# EAGLE design CharlieBreakout (EAGLE 6.5.0)
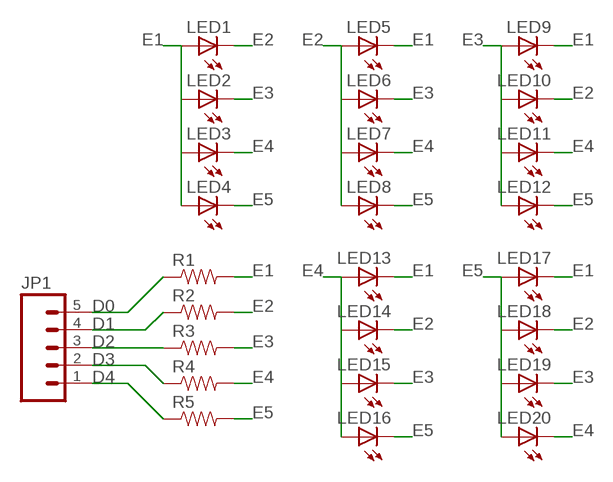
[diagram p0: schematic, sheet 1]

## Parts
JP1  M05PTH  [1X05]
LED1  LED3MM  [LED3MM]
LED2  LED3MM  [LED3MM]
LED3  LED3MM  [LED3MM]
LED4  LED3MM  [LED3MM]
LED5  LED3MM  [LED3MM]
LED6  LED3MM  [LED3MM]
LED7  LED3MM  [LED3MM]
LED8  LED3MM  [LED3MM]
LED9  LED3MM  [LED3MM]
LED10  LED3MM  [LED3MM]
LED11  LED3MM  [LED3MM]
LED12  LED3MM  [LED3MM]
LED13  LED3MM  [LED3MM]
LED14  LED3MM  [LED3MM]
LED15  LED3MM  [LED3MM]
LED16  LED3MM  [LED3MM]
LED17  LED3MM  [LED3MM]
LED18  LED3MM  [LED3MM]
LED19  LED3MM  [LED3MM]
LED20  LED3MM  [LED3MM]
R1  RESISTORAXIAL-0.3  [AXIAL-0.3]
R2  RESISTORAXIAL-0.3  [AXIAL-0.3]
R3  RESISTORAXIAL-0.3  [AXIAL-0.3]
R4  RESISTORAXIAL-0.3  [AXIAL-0.3]
R5  RESISTORAXIAL-0.3  [AXIAL-0.3]

## Nets
D0: JP1.5 R1.P$1
D1: JP1.4 R2.P$1
D2: JP1.3 R3.P$1
D3: JP1.2 R4.P$1
D4: JP1.1 R5.P$1
E1: LED1.A LED2.A LED3.A LED4.A LED5.K(C) LED9.K(C) LED13.K(C) LED17.K(C) R1.P$2
E2: LED1.K(C) LED5.A LED6.A LED7.A LED8.A LED10.K(C) LED14.K(C) LED18.K(C) R2.P$2
E3: LED2.K(C) LED6.K(C) LED9.A LED10.A LED11.A LED12.A LED15.K(C) LED19.K(C) R3.P$2
E4: LED3.K(C) LED7.K(C) LED11.K(C) LED13.A LED14.A LED15.A LED16.A LED20.K(C) R4.P$2
E5: LED4.K(C) LED8.K(C) LED12.K(C) LED16.K(C) LED17.A LED18.A LED19.A LED20.A R5.P$2

## Library data of the parts
JP1 = SparkFun-Connectors:M05: Header 5 Standard 5-pin 0.1" header. Use with straight break away headers (SKU : PRT-00116), right angle break away headers (PRT-00553), swiss pins (PRT-00743), machine pins (PRT-00117), and female headers (PRT-00115). Molex polarized connector foot print use with SKU : PRT-08230 with associated crimp pins and housings.
LED1-LED20 = SparkFun-LED:LED: LEDs Standard schematic elements and footprints for 5mm, 3mm, 1206, and 0603 sized LEDs. 5mm - Spark Fun Electronics SKU : COM-00529 (and others)
R1-R5 = SparkFun-Resistors:RESISTOR: Resistor Basic schematic elements and footprints for 0603, 1206, and PTH resistors.

## Board
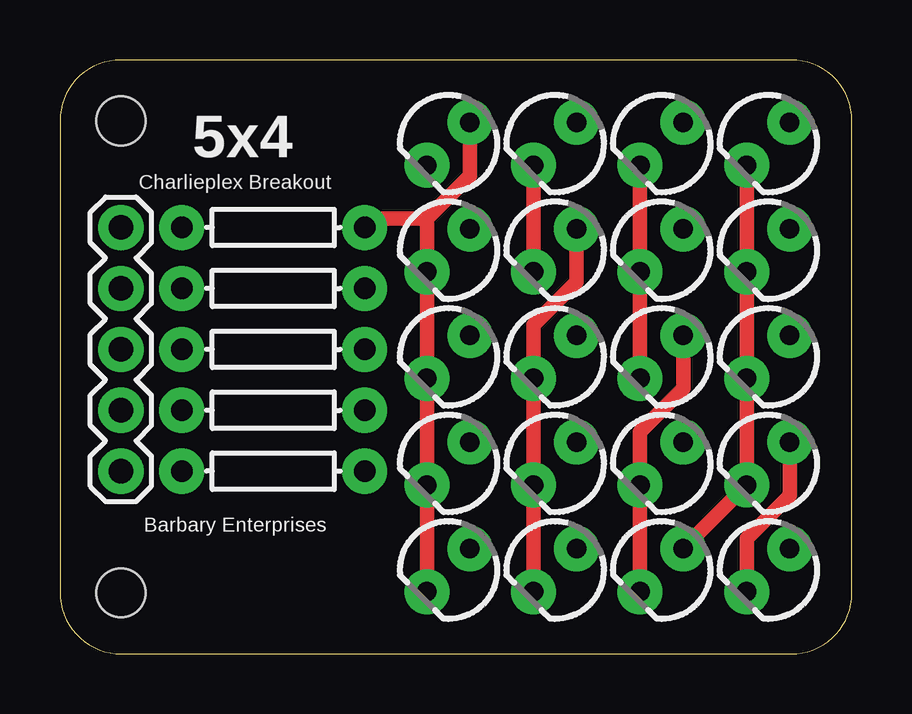
[diagram p1: board, top side]
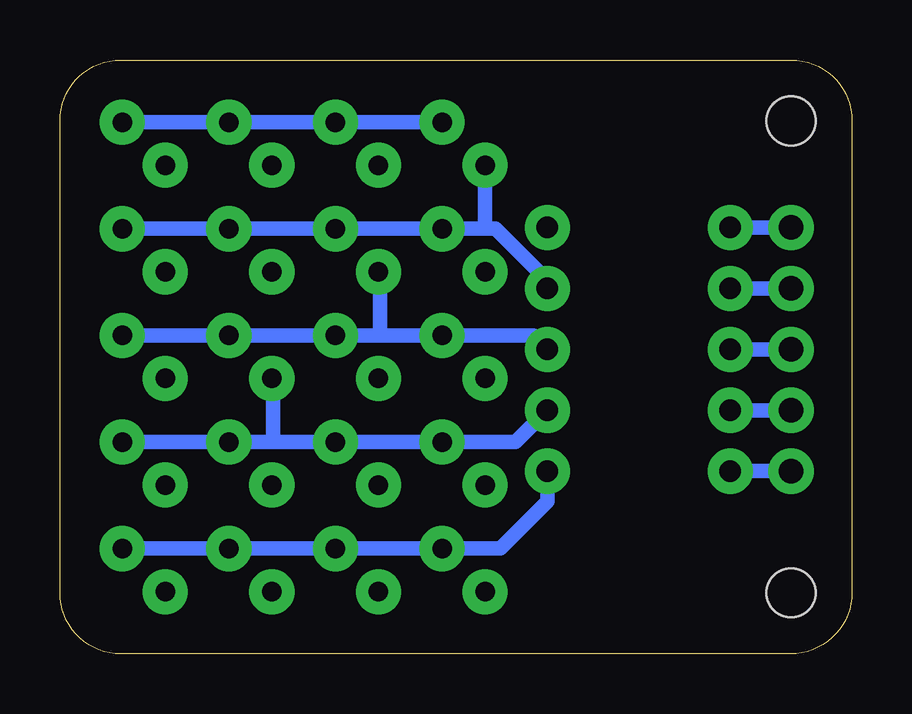
[diagram p2: board, bottom side, seen from below]

Size 33.02 x 24.77 mm. Coordinates in mm from the lower left corner, seen from the top.
Outline: 30.48,24.77 2.54,24.77 arc90 0,22.23 0,2.56 arc90 2.56,0 30.48,0 arc90 33.02,2.54 33.02,22.23 arc90 30.48,24.77
Copper layers (1*16): Top 0.0356mm / dielectric 1.5011mm / Bottom 0.0356mm
Design rules "LaenPCBOrder": minimum track width 6mil, minimum drill 13mil, track to track 6mil, track to pad 6mil, pad to pad 6mil, via to via 6mil, smd to smd 6mil, copper to edge 15mil, drill to drill 6mil, minimum pad ring 7mil, minimum via ring 7mil, stop-mask expansion 3mil, vias tented up to drill 0mil, thermal gap 10mil
Holes 2.03 mm at 2.54,2.54 2.54,22.23

### Footprints (pad centres in the part's own frame; a part is rotated, then mirrored left to right if it is on the bottom)
1X05 = drill 1.016 pad 1.88: 1 0,0; 2 2.54,0; 3 5.08,0; 4 7.62,0; 5 10.16,0
LED3MM = drill 0.813 pad 1.88: A -1.27,0; K 1.27,0
AXIAL-0.3 = drill 0.9 pad 1.88: P$1 -3.81,0; P$2 3.81,0

### Placement (x,y rotation side)
JP1  2.54,7.62 90 top
LED1  16.19,21.27 225 top
LED2  20.64,21.27 225 top
LED3  25.08,21.27 225 top
LED4  29.53,21.27 225 top
LED5  16.19,16.83 225 top
LED6  20.64,16.83 225 top
LED7  25.08,16.83 225 top
LED8  29.53,16.83 225 top
LED9  16.19,12.38 225 top
LED10  20.64,12.38 225 top
LED11  25.08,12.38 225 top
LED12  29.53,12.38 225 top
LED13  16.19,7.94 225 top
LED14  20.64,7.94 225 top
LED15  25.08,7.94 225 top
LED16  29.53,7.94 225 top
LED17  16.19,3.49 225 top
LED18  20.64,3.49 225 top
LED19  25.08,3.49 225 top
LED20  29.53,3.49 225 top
R1  8.89,17.78 0 top
R2  8.89,15.24 0 top
R3  8.89,12.7 0 top
R4  8.89,10.16 0 top
R5  8.89,7.62 0 top

### Tracks (layer width: path | path; a pad name or v marks a point on that pad's centre or on a via)
D0
  Bottom 0.61: JP1.5 R1.P$1
D1
  Bottom 0.61: JP1.4 R2.P$1
D2
  Bottom 0.61: JP1.3 R3.P$1
D3
  Bottom 0.61: JP1.2 R4.P$1
D4
  Bottom 0.61: JP1.1 R5.P$1
E1
  Top 0.61: LED17.K LED13.K LED9.K LED5.K 15.29,18.15 | 15.29,18.15 17.09,19.95 LED1.A | 15.29,18.15 13.07,18.15 R1.P$2
  Bottom 0.61: LED4.A LED3.A LED2.A LED1.A
E2
  Top 0.61: LED18.K LED14.K LED10.K 19.74,13.71 21.54,15.5 LED6.A
  Bottom 0.61: LED8.A LED7.A LED6.A LED5.A 15.24,17.73 | 15.24,17.73 14.87,17.73 13.02,15.88 13.02,15.56 R2.P$2 | LED1.K 15.29,17.78 15.24,17.73
E3
  Top 0.61: LED19.K LED15.K 24.18,9.26 25.98,11.06 LED11.A | LED2.K LED6.K
  Bottom 0.61: LED12.A LED11.A LED10.A 19.68,13.28 | 19.68,13.28 LED9.A 13.28,13.28 R3.P$2 | LED6.K 19.68,15.88 19.68,13.28
E4
  Top 0.61: LED20.K 28.63,4.82 30.43,6.61 LED16.A | LED3.K LED7.K LED11.K
  Bottom 0.61: 24.13,8.84 LED14.A LED13.A 14.02,8.84 R4.P$2 | 24.13,8.84 LED15.A LED16.A | LED11.K 24.13,11.43 24.13,8.84
E5
  Top 0.61: LED4.K LED8.K LED12.K LED16.K LED19.A
  Bottom 0.61: LED20.A LED19.A LED18.A LED17.A 14.66,4.39 12.7,6.35 R5.P$2

### Text on the board
tPlace: 5x4 | Charlieplex Breakout | Barbary Enterprises